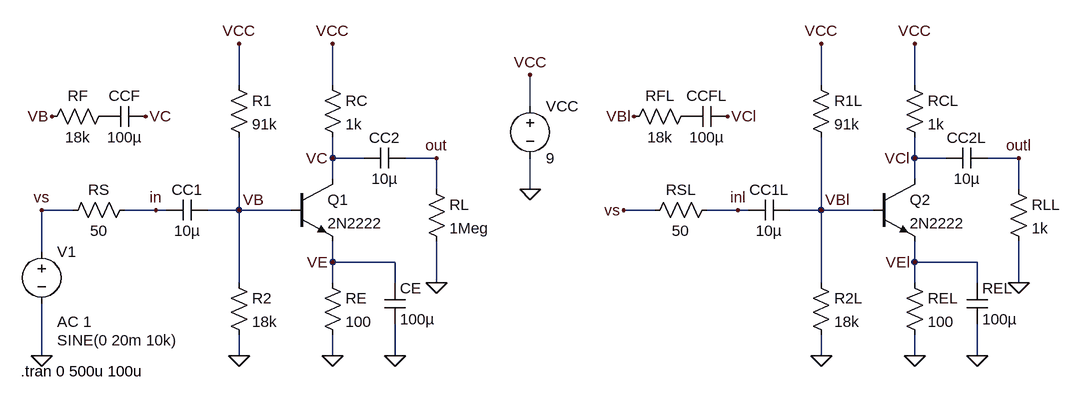
[diagram p0: schematic Perc-03-03-outputresistance.asc]
Perc-03-03-outputresistance.asc, the LTspice schematic file:
Version 4
SHEET 1 1416 680
WIRE 128 48 128 -16
WIRE 272 48 272 -16
WIRE 1024 48 1024 -16
WIRE 1168 48 1168 -16
WIRE 576 80 576 32
WIRE 272 160 272 128
WIRE 320 160 272 160
WIRE 432 160 384 160
WIRE 1168 160 1168 128
WIRE 1216 160 1168 160
WIRE 1328 160 1280 160
WIRE 272 192 272 160
WIRE 1168 192 1168 160
WIRE 432 208 432 160
WIRE 576 208 576 160
WIRE 1328 208 1328 160
WIRE -128 240 -176 240
WIRE 0 240 -48 240
WIRE 16 240 0 240
WIRE 128 240 128 128
WIRE 128 240 80 240
WIRE 208 240 128 240
WIRE 768 240 720 240
WIRE 896 240 848 240
WIRE 912 240 896 240
WIRE 1024 240 1024 128
WIRE 1024 240 976 240
WIRE 1104 240 1024 240
WIRE -176 304 -176 240
WIRE 272 320 272 288
WIRE 368 320 272 320
WIRE 1168 320 1168 288
WIRE 1264 320 1168 320
WIRE 128 352 128 240
WIRE 272 352 272 320
WIRE 368 352 368 320
WIRE 432 352 432 288
WIRE 1024 352 1024 240
WIRE 1168 352 1168 320
WIRE 1264 352 1264 320
WIRE 1328 352 1328 288
WIRE -176 464 -176 384
WIRE 128 464 128 432
WIRE 272 464 272 432
WIRE 368 464 368 416
WIRE 1024 464 1024 432
WIRE 1168 464 1168 432
WIRE 1264 464 1264 416
FLAG 368 464 0
FLAG 272 464 0
FLAG 128 464 0
FLAG 128 -16 VCC
FLAG 272 -16 VCC
FLAG 432 352 0
FLAG 576 208 0
FLAG 576 32 VCC
FLAG -176 464 0
FLAG 0 240 in
FLAG 432 160 out
FLAG 128 240 VB
FLAG 272 320 VE
FLAG 272 160 VC
FLAG -16 96 VC
FLAG -160 96 VB
FLAG 1264 464 0
FLAG 1168 464 0
FLAG 1024 464 0
FLAG 1024 -16 VCC
FLAG 1168 -16 VCC
FLAG 1328 352 0
FLAG 896 240 inl
FLAG 1328 160 outl
FLAG 1024 240 VBl
FLAG 1168 320 VEl
FLAG 1168 160 VCl
FLAG 880 96 VCl
FLAG 736 96 VBl
FLAG 720 240 vs
FLAG -176 240 vs
SYMBOL npn 208 192 R0
SYMATTR InstName Q1
SYMATTR Value 2N2222
SYMBOL res 256 32 R0
SYMATTR InstName RC
SYMATTR Value 1k
SYMBOL res 112 32 R0
SYMATTR InstName R1
SYMATTR Value 91k
SYMBOL res 112 336 R0
SYMATTR InstName R2
SYMATTR Value 18k
SYMBOL res 256 336 R0
SYMATTR InstName RE
SYMATTR Value 100
SYMBOL cap 352 352 R0
SYMATTR InstName CE
SYMATTR Value 100µ
SYMBOL cap 384 144 R90
WINDOW 0 0 32 VBottom 2
WINDOW 3 32 32 VTop 2
SYMATTR InstName CC2
SYMATTR Value 10µ
SYMBOL cap 80 224 R90
WINDOW 0 0 32 VBottom 2
WINDOW 3 32 32 VTop 2
SYMATTR InstName CC1
SYMATTR Value 10µ
SYMBOL res 416 192 R0
SYMATTR InstName RL
SYMATTR Value 1Meg
SYMBOL voltage -176 288 R0
WINDOW 3 24 152 Left 2
WINDOW 123 24 124 Left 2
WINDOW 39 0 0 Left 0
SYMATTR Value SINE(0 20m 10k)
SYMATTR Value2 AC 1
SYMATTR InstName V1
SYMBOL voltage 576 64 R0
SYMATTR InstName VCC
SYMATTR Value 9
SYMBOL res -32 224 R90
WINDOW 0 0 56 VBottom 2
WINDOW 3 32 56 VTop 2
SYMATTR InstName RS
SYMATTR Value 50
SYMBOL res -64 80 R90
WINDOW 0 0 56 VBottom 2
WINDOW 3 32 56 VTop 2
SYMATTR InstName RF
SYMATTR Value 18k
SYMBOL cap -16 80 R90
WINDOW 0 0 32 VBottom 2
WINDOW 3 32 32 VTop 2
SYMATTR InstName CCF
SYMATTR Value 100µ
SYMBOL npn 1104 192 R0
SYMATTR InstName Q2
SYMATTR Value 2N2222
SYMBOL res 1152 32 R0
SYMATTR InstName RCL
SYMATTR Value 1k
SYMBOL res 1008 32 R0
SYMATTR InstName R1L
SYMATTR Value 91k
SYMBOL res 1008 336 R0
SYMATTR InstName R2L
SYMATTR Value 18k
SYMBOL res 1152 336 R0
SYMATTR InstName REL
SYMATTR Value 100
SYMBOL cap 1248 352 R0
SYMATTR InstName REL
SYMATTR Value 100µ
SYMBOL cap 1280 144 R90
WINDOW 0 0 32 VBottom 2
WINDOW 3 32 32 VTop 2
SYMATTR InstName CC2L
SYMATTR Value 10µ
SYMBOL cap 976 224 R90
WINDOW 0 0 32 VBottom 2
WINDOW 3 32 32 VTop 2
SYMATTR InstName CC1L
SYMATTR Value 10µ
SYMBOL res 1312 192 R0
SYMATTR InstName RLL
SYMATTR Value 1k
SYMBOL res 864 224 R90
WINDOW 0 0 56 VBottom 2
WINDOW 3 32 56 VTop 2
SYMATTR InstName RSL
SYMATTR Value 50
SYMBOL res 832 80 R90
WINDOW 0 0 56 VBottom 2
WINDOW 3 32 56 VTop 2
SYMATTR InstName RFL
SYMATTR Value 18k
SYMBOL cap 880 80 R90
WINDOW 0 0 32 VBottom 2
WINDOW 3 32 32 VTop 2
SYMATTR InstName CCFL
SYMATTR Value 100µ
TEXT -208 488 Left 2 !.tran 0 500u 100u

The netlist it stands for:
* Perc-03-03-outputresistance.asc
Q1 VC VB VE 0 2N2222
RC VCC VC 1k
R1 VCC VB 91k
R2 VB 0 18k
RE VE 0 100
CE VE 0 100µ
CC2 out VC 10µ
CC1 VB in 10µ
RL out 0 1Meg
V1 vs 0 SINE(0 20m 10k) AC 1
VCC VCC 0 9
RS in vs 50
RF P001 VB 18k
CCF VC P001 100µ
Q2 VCl VBl VEl 0 2N2222
RCL VCC VCl 1k
R1L VCC VBl 91k
R2L VBl 0 18k
REL VEl 0 100
C§REL VEl 0 100µ
CC2L outl VCl 10µ
CC1L VBl inl 10µ
RLL outl 0 1k
RSL inl vs 50
RFL P002 VBl 18k
CCFL VCl P002 100µ
.model NPN NPN
.model PNP PNP
.lib standard.bjt
.tran 0 500u 100u
.backanno
.end